# EAGLE schematic 16ch_omn_hirose_adapter_400mil (EAGLE 7.3.0)
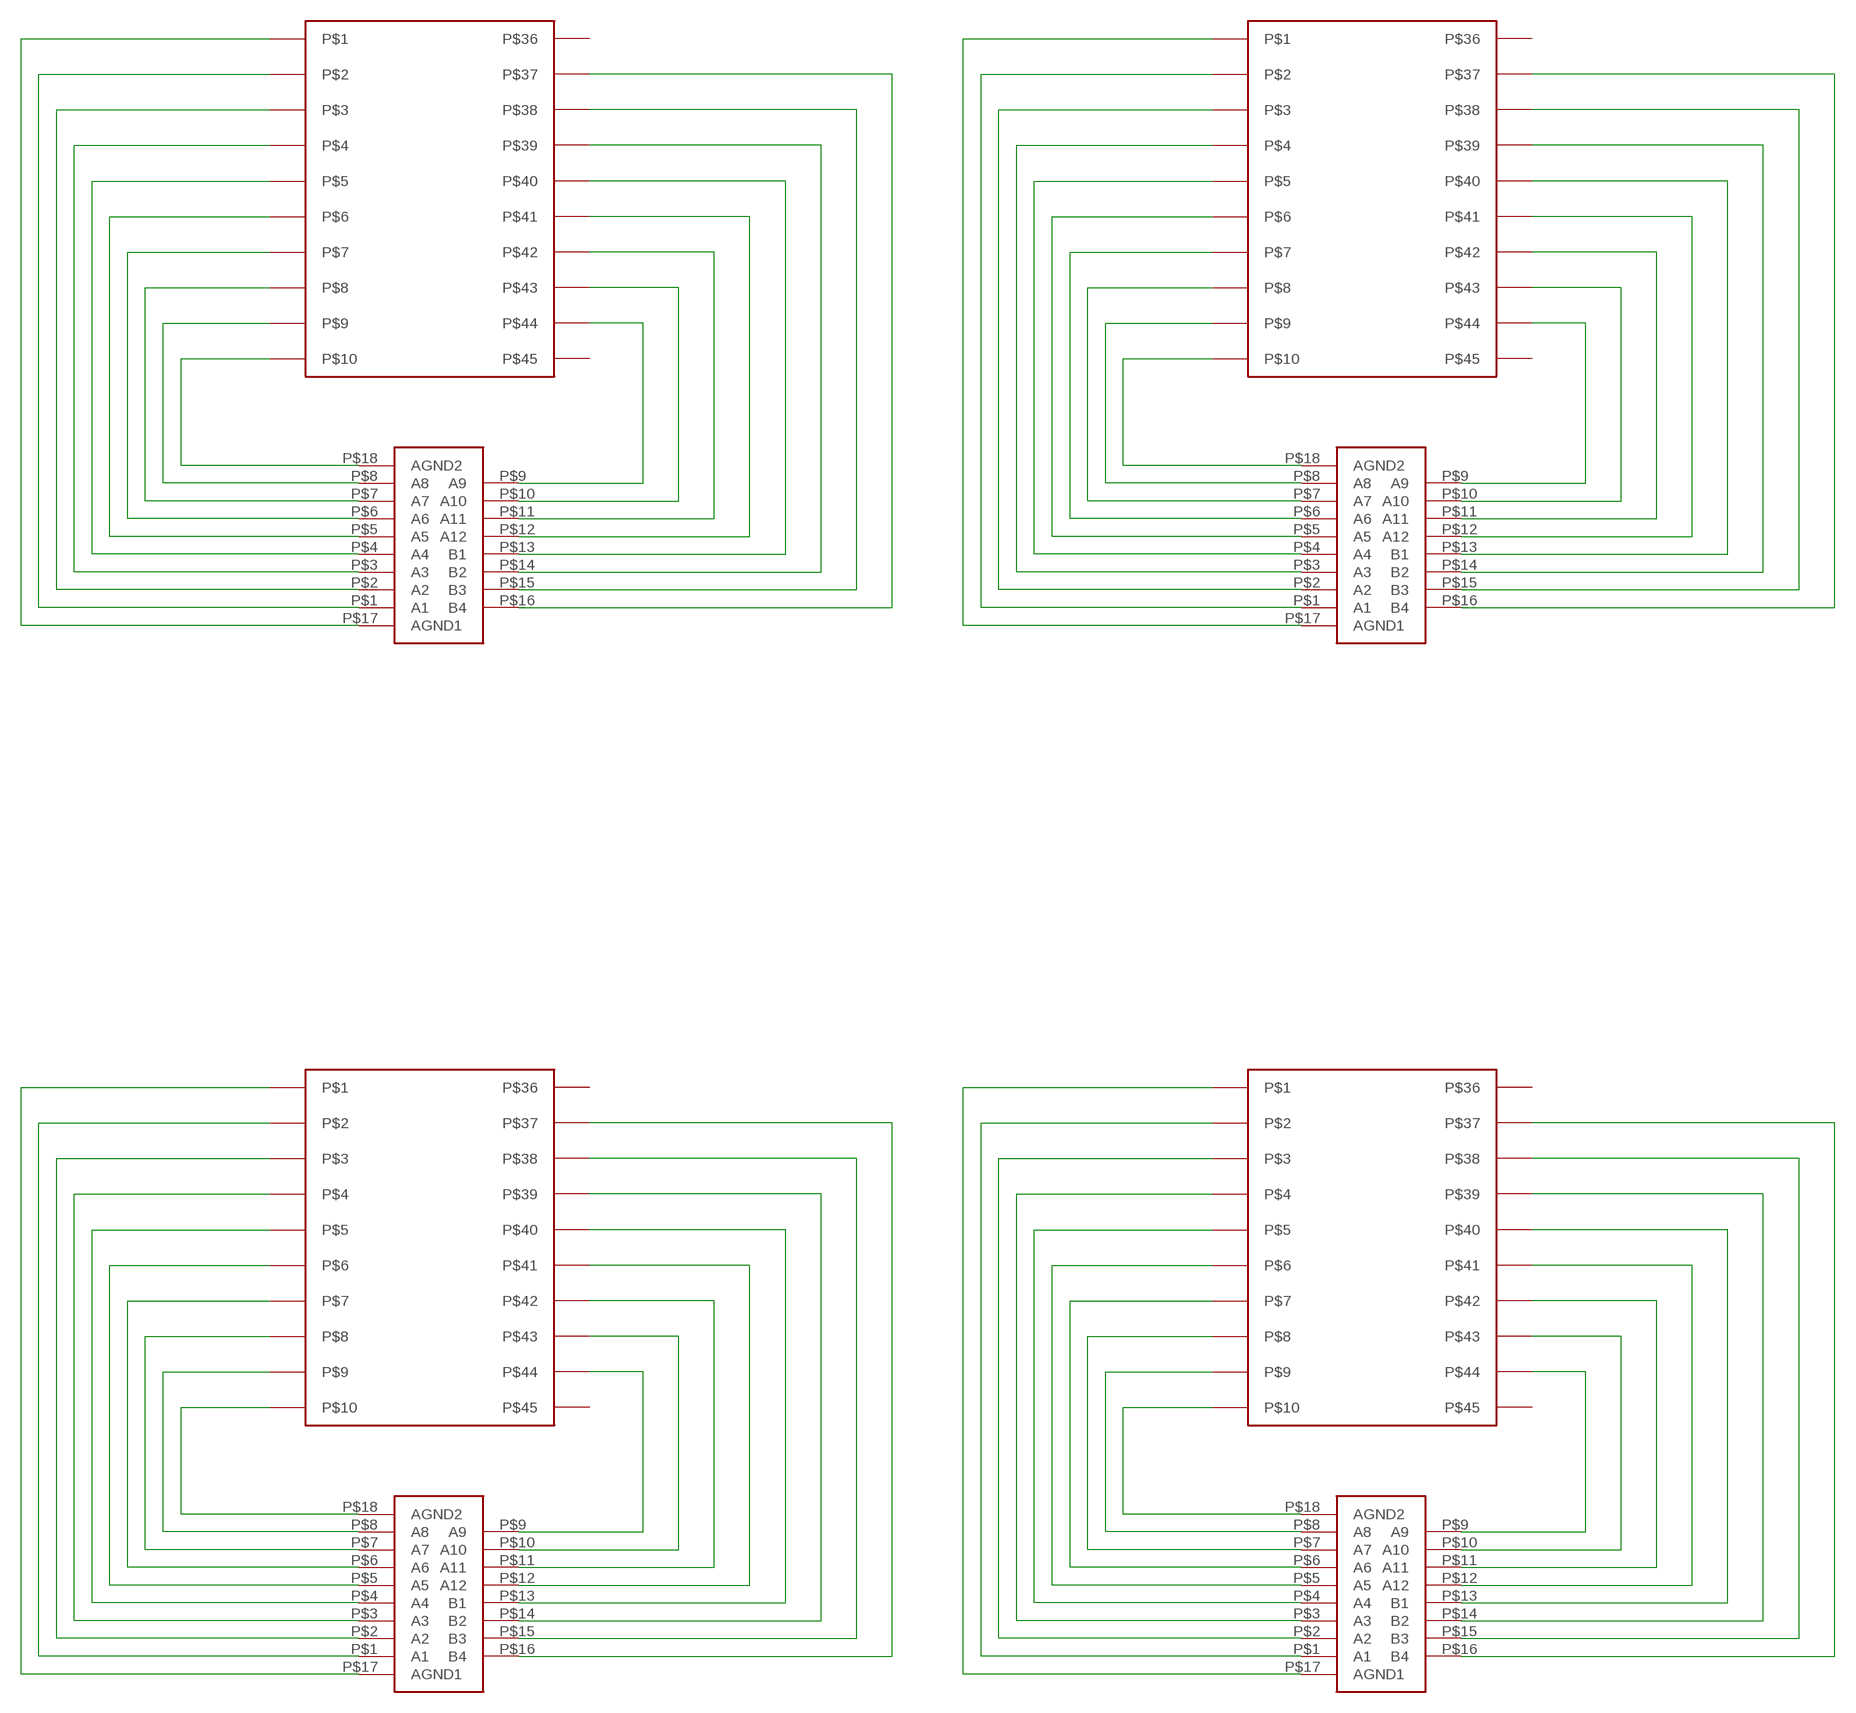
[diagram p0: schematic, sheet 1]

## Parts
U$1  HIROSE_DF40_70PIN  [HIROSE_DF40C-70DS]
U$2  OMNETICS_FE18  [OMNETICS_FE18]
U$3  HIROSE_DF40_70PIN  [HIROSE_DF40C-70DS]
U$4  OMNETICS_FE18  [OMNETICS_FE18]
U$5  HIROSE_DF40_70PIN  [HIROSE_DF40C-70DS]
U$6  OMNETICS_FE18  [OMNETICS_FE18]
U$7  HIROSE_DF40_70PIN  [HIROSE_DF40C-70DS]
U$8  OMNETICS_FE18  [OMNETICS_FE18]

## Nets
N$1: U$1.P$10 U$2.P$18(AGND2)
N$2: U$1.P$9 U$2.P$8(A8)
N$3: U$1.P$8 U$2.P$7(A7)
N$4: U$1.P$7 U$2.P$6(A6)
N$5: U$1.P$6 U$2.P$5(A5)
N$6: U$1.P$5 U$2.P$4(A4)
N$7: U$1.P$4 U$2.P$3(A3)
N$8: U$1.P$3 U$2.P$2(A2)
N$9: U$1.P$2 U$2.P$1(A1)
N$10: U$1.P$1 U$2.P$17(AGND1)
N$11: U$1.P$44 U$2.P$9(A9)
N$12: U$1.P$43 U$2.P$10(A10)
N$13: U$1.P$42 U$2.P$11(A11)
N$14: U$1.P$41 U$2.P$12(A12)
N$15: U$1.P$40 U$2.P$13(B1)
N$16: U$1.P$39 U$2.P$14(B2)
N$17: U$1.P$38 U$2.P$15(B3)
N$18: U$1.P$37 U$2.P$16(B4)
N$19: U$3.P$10 U$4.P$18(AGND2)
N$20: U$3.P$9 U$4.P$8(A8)
N$21: U$3.P$8 U$4.P$7(A7)
N$22: U$3.P$7 U$4.P$6(A6)
N$23: U$3.P$6 U$4.P$5(A5)
N$24: U$3.P$5 U$4.P$4(A4)
N$25: U$3.P$4 U$4.P$3(A3)
N$26: U$3.P$3 U$4.P$2(A2)
N$27: U$3.P$2 U$4.P$1(A1)
N$28: U$3.P$1 U$4.P$17(AGND1)
N$29: U$3.P$44 U$4.P$9(A9)
N$30: U$3.P$43 U$4.P$10(A10)
N$31: U$3.P$42 U$4.P$11(A11)
N$32: U$3.P$41 U$4.P$12(A12)
N$33: U$3.P$40 U$4.P$13(B1)
N$34: U$3.P$39 U$4.P$14(B2)
N$35: U$3.P$38 U$4.P$15(B3)
N$36: U$3.P$37 U$4.P$16(B4)
N$37: U$5.P$10 U$6.P$18(AGND2)
N$38: U$5.P$9 U$6.P$8(A8)
N$39: U$5.P$8 U$6.P$7(A7)
N$40: U$5.P$7 U$6.P$6(A6)
N$41: U$5.P$6 U$6.P$5(A5)
N$42: U$5.P$5 U$6.P$4(A4)
N$43: U$5.P$4 U$6.P$3(A3)
N$44: U$5.P$3 U$6.P$2(A2)
N$45: U$5.P$2 U$6.P$1(A1)
N$46: U$5.P$1 U$6.P$17(AGND1)
N$47: U$5.P$44 U$6.P$9(A9)
N$48: U$5.P$43 U$6.P$10(A10)
N$49: U$5.P$42 U$6.P$11(A11)
N$50: U$5.P$41 U$6.P$12(A12)
N$51: U$5.P$40 U$6.P$13(B1)
N$52: U$5.P$39 U$6.P$14(B2)
N$53: U$5.P$38 U$6.P$15(B3)
N$54: U$5.P$37 U$6.P$16(B4)
N$55: U$7.P$10 U$8.P$18(AGND2)
N$56: U$7.P$9 U$8.P$8(A8)
N$57: U$7.P$8 U$8.P$7(A7)
N$58: U$7.P$7 U$8.P$6(A6)
N$59: U$7.P$6 U$8.P$5(A5)
N$60: U$7.P$5 U$8.P$4(A4)
N$61: U$7.P$4 U$8.P$3(A3)
N$62: U$7.P$3 U$8.P$2(A2)
N$63: U$7.P$2 U$8.P$1(A1)
N$64: U$7.P$1 U$8.P$17(AGND1)
N$65: U$7.P$44 U$8.P$9(A9)
N$66: U$7.P$43 U$8.P$10(A10)
N$67: U$7.P$42 U$8.P$11(A11)
N$68: U$7.P$41 U$8.P$12(A12)
N$69: U$7.P$40 U$8.P$13(B1)
N$70: U$7.P$39 U$8.P$14(B2)
N$71: U$7.P$38 U$8.P$15(B3)
N$72: U$7.P$37 U$8.P$16(B4)
Unconnected: U$1.P$36 U$1.P$45 U$3.P$36 U$3.P$45 U$5.P$36 U$5.P$45 U$7.P$36 U$7.P$45

## Library data of the parts
U$1 U$3 U$5 U$7 = GG_hirose20:HIROSE_DF40_70PIN
U$2 U$4 U$6 U$8 = connectors:OMNETICS_FE18